# Altium project ChristmasTree.PrjPcb
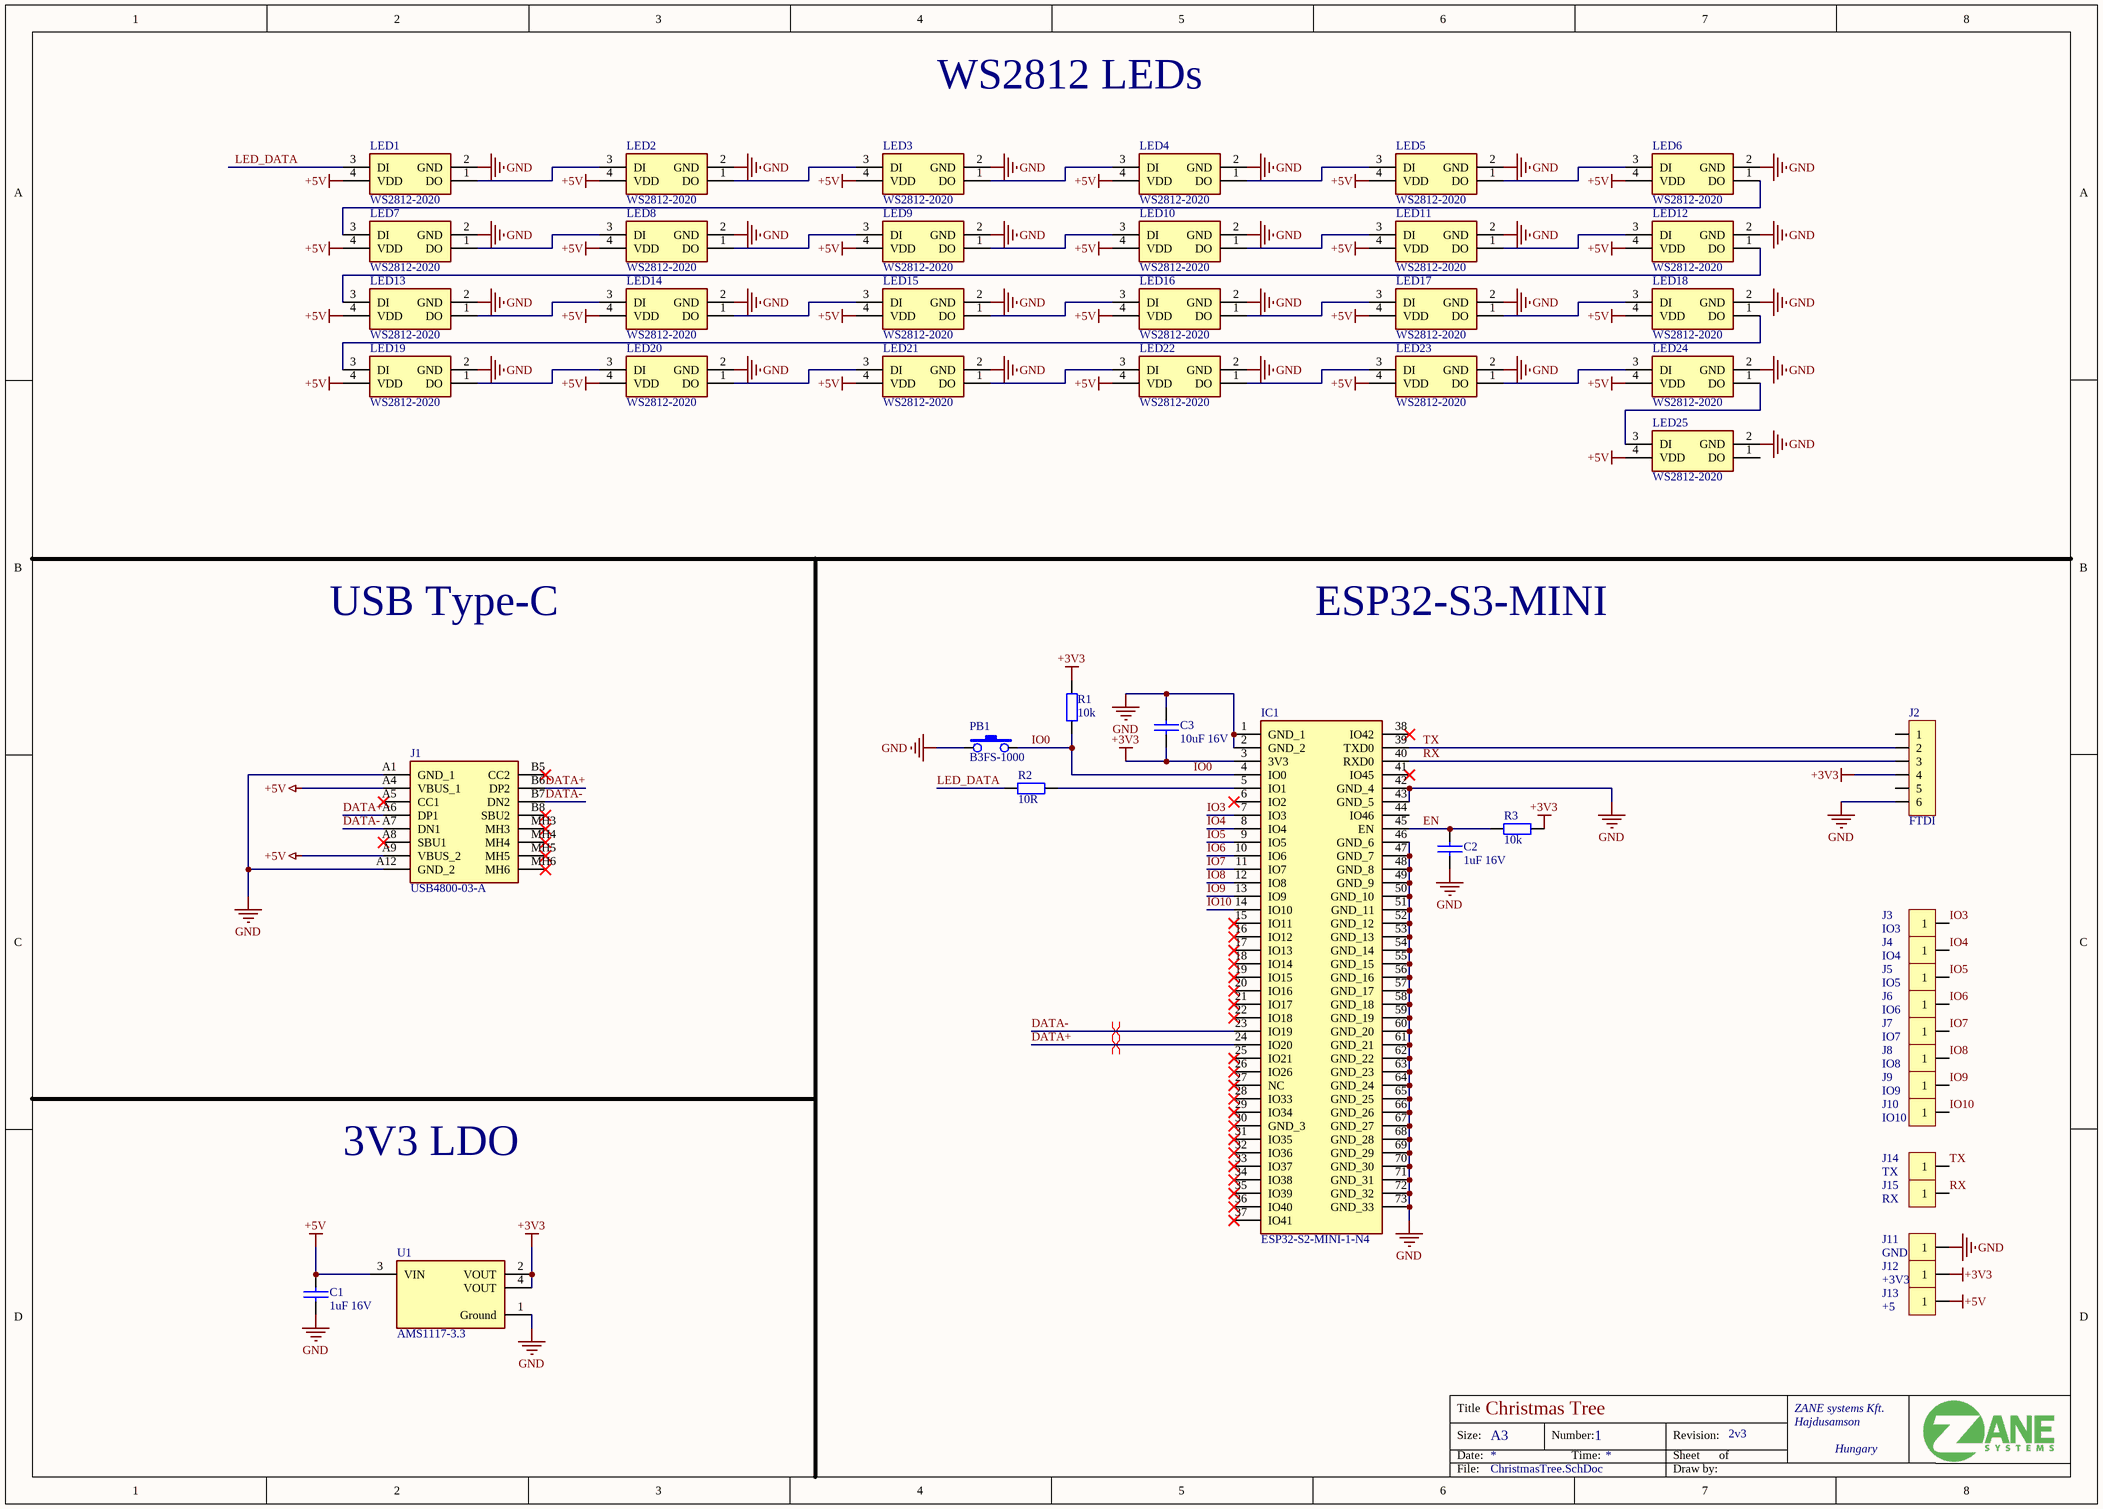
[diagram p0: ChristmasTree.SchDoc]
1 sheet, 49 parts. Net scope: global (net labels, ports and power ports of the same name join across sheets).
Board files: ChristmasTree.PcbDoc, ChristmasTree_x3_panellized.PcbDoc

## Sheet ChristmasTree.SchDoc: Christmas Tree
size A3; DrawnBy: ZANE systems Kft.; Organization: ZANE systems Kft.; Address1: Hajdusamson; Address4: Hungary; DocumentNumber: 1; Revision: 2v3; SheetNumber: 1; SheetTotal: 1

### Parts
C1  1uF 16V  [Z_0603_C]
C2  1uF 16V  [Z_0603_C]
C3  10uF 16V  [Z_0603_C]
IC1  ESP32-S2-MINI-1-N4  [ESP32S2MINI1N4]
J1  USB4800-03-A  [USB480003A]
J2  FTDI  [TUSKE1X6_2.54MM]
J3  IO3  [SMD_PAD]
J4  IO4  [SMD_PAD]
J5  IO5  [SMD_PAD]
J6  IO6  [SMD_PAD]
J7  IO7  [SMD_PAD]
J8  IO8  [SMD_PAD]
J9  IO9  [SMD_PAD]
J10  IO10  [SMD_PAD]
J11  GND  [SMD_PAD]
J12  +3V3  [SMD_PAD]
J13  +5  [SMD_PAD]
J14  TX  [SMD_PAD]
J15  RX  [SMD_PAD]
LED1  WS2812-2020  [WS28122020]
LED2  WS2812-2020  [WS28122020]
LED3  WS2812-2020  [WS28122020]
LED4  WS2812-2020  [WS28122020]
LED5  WS2812-2020  [WS28122020]
LED6  WS2812-2020  [WS28122020]
LED7  WS2812-2020  [WS28122020]
LED8  WS2812-2020  [WS28122020]
LED9  WS2812-2020  [WS28122020]
LED10  WS2812-2020  [WS28122020]
LED11  WS2812-2020  [WS28122020]
LED12  WS2812-2020  [WS28122020]
LED13  WS2812-2020  [WS28122020]
LED14  WS2812-2020  [WS28122020]
LED15  WS2812-2020  [WS28122020]
LED16  WS2812-2020  [WS28122020]
LED17  WS2812-2020  [WS28122020]
LED18  WS2812-2020  [WS28122020]
LED19  WS2812-2020  [WS28122020]
LED20  WS2812-2020  [WS28122020]
LED21  WS2812-2020  [WS28122020]
LED22  WS2812-2020  [WS28122020]
LED23  WS2812-2020  [WS28122020]
LED24  WS2812-2020  [WS28122020]
LED25  WS2812-2020  [WS28122020]
PB1  B3FS-1000  [dtsm3]
R1  10k  [z_0603_r]
R2  10R  [z_0603_r]
R3  10k  [z_0603_r]
U1  AMS1117-3.3  [FP-AMS1117-IPC_C]

### Nets
+3V3: C3.1 IC1.3(3V3) J2.4 J12.1 R1.2 R3.1 U1.2(VOUT) U1.4(VOUT)
+5V: C1.1 J1.A4(VBUS_1) J1.A9(VBUS_2) J13.1 LED1.4(VDD) LED2.4(VDD) LED3.4(VDD) LED4.4(VDD) LED5.4(VDD) LED6.4(VDD) LED7.4(VDD) LED8.4(VDD) LED9.4(VDD) LED10.4(VDD) LED11.4(VDD) LED12.4(VDD) LED13.4(VDD) LED14.4(VDD) LED15.4(VDD) LED16.4(VDD) LED17.4(VDD) LED18.4(VDD) LED19.4(VDD) LED20.4(VDD) LED21.4(VDD) LED22.4(VDD) LED23.4(VDD) LED24.4(VDD) LED25.4(VDD) U1.3(VIN)
GND: C1.2 C2.2 C3.2 IC1.1(GND_1) IC1.2(GND_2) IC1.42(GND_4) IC1.43(GND_5) IC1.46(GND_6) IC1.47(GND_7) IC1.48(GND_8) IC1.49(GND_9) IC1.50(GND_10) IC1.51(GND_11) IC1.52(GND_12) IC1.53(GND_13) IC1.54(GND_14) IC1.55(GND_15) IC1.56(GND_16) IC1.57(GND_17) IC1.58(GND_18) IC1.59(GND_19) IC1.60(GND_20) IC1.61(GND_21) IC1.62(GND_22) IC1.63(GND_23) IC1.64(GND_24) IC1.65(GND_25) IC1.66(GND_26) IC1.67(GND_27) IC1.68(GND_28) IC1.69(GND_29) IC1.70(GND_30) IC1.71(GND_31) IC1.72(GND_32) IC1.73(GND_33) J1.A1(GND_1) J1.A12(GND_2) J2.6 J11.1 LED1.2(GND) LED2.2(GND) LED3.2(GND) LED4.2(GND) LED5.2(GND) LED6.2(GND) LED7.2(GND) LED8.2(GND) LED9.2(GND) LED10.2(GND) LED11.2(GND) LED12.2(GND) LED13.2(GND) LED14.2(GND) LED15.2(GND) LED16.2(GND) LED17.2(GND) LED18.2(GND) LED19.2(GND) LED20.2(GND) LED21.2(GND) LED22.2(GND) LED23.2(GND) LED24.2(GND) LED25.2(GND) PB1.1 U1.1(Ground)
DATA+: IC1.24(IO20) J1.A6(DP1) J1.B6(DP2)
DATA-: IC1.23(IO19) J1.A7(DN1) J1.B7(DN2)
EN: C2.1 IC1.45(EN) R3.2
IO0: IC1.4(IO0) PB1.2 R1.1
IO3: IC1.7(IO3) J3.1
IO4: IC1.8(IO4) J4.1
IO5: IC1.9(IO5) J5.1
IO6: IC1.10(IO6) J6.1
IO7: IC1.11(IO7) J7.1
IO8: IC1.12(IO8) J8.1
IO9: IC1.13(IO9) J9.1
IO10: IC1.14(IO10) J10.1
LED_DATA: LED1.3(DI) R2.2
RX: IC1.40(RXD0) J2.3 J15.1
TX: IC1.39(TXD0) J2.2 J14.1
NetIC1_5: IC1.5(IO1) R2.1
NetLED1_1: LED1.1(DO) LED2.3(DI)
NetLED2_1: LED2.1(DO) LED3.3(DI)
NetLED3_1: LED3.1(DO) LED4.3(DI)
NetLED4_1: LED4.1(DO) LED5.3(DI)
NetLED5_1: LED5.1(DO) LED6.3(DI)
NetLED6_1: LED6.1(DO) LED7.3(DI)
NetLED7_1: LED7.1(DO) LED8.3(DI)
NetLED8_1: LED8.1(DO) LED9.3(DI)
NetLED9_1: LED9.1(DO) LED10.3(DI)
NetLED10_1: LED10.1(DO) LED11.3(DI)
NetLED11_1: LED11.1(DO) LED12.3(DI)
NetLED12_1: LED12.1(DO) LED13.3(DI)
NetLED13_1: LED13.1(DO) LED14.3(DI)
NetLED14_1: LED14.1(DO) LED15.3(DI)
NetLED15_1: LED15.1(DO) LED16.3(DI)
NetLED16_1: LED16.1(DO) LED17.3(DI)
NetLED17_1: LED17.1(DO) LED18.3(DI)
NetLED18_1: LED18.1(DO) LED19.3(DI)
NetLED19_1: LED19.1(DO) LED20.3(DI)
NetLED20_1: LED20.1(DO) LED21.3(DI)
NetLED21_1: LED21.1(DO) LED22.3(DI)
NetLED22_1: LED22.1(DO) LED23.3(DI)
NetLED23_1: LED23.1(DO) LED24.3(DI)
NetLED24_1: LED24.1(DO) LED25.3(DI)

Not connected (* = marked no-connect by the designer): IC1 6(IO2)* 15(IO11)* 16(IO12)* 17(IO13)* 18(IO14)* 19(IO15)* 20(IO16)* 21(IO17)* 22(IO18)* 25(IO21)* 26(IO26)* 27(NC)* 28(IO33)* 29(IO34)* 30(GND_3)* 31(IO35)* 32(IO36)* 33(IO37)* 34(IO38)* 35(IO39)* 36(IO40)* 37(IO41)* 38(IO42)* 41(IO45)* 44(IO46); J1 A5(CC1)* A8(SBU1)* B5(CC2)* B8(SBU2)* MH3* MH4* MH5* MH6*; J2 1 5; LED25 1(DO)

### Layout directives
differential pair: DATA+, DATA-

### Notes on the sheet
- WS2812 LEDs
- USB Type-C
- ESP32-S3-MINI
- 3V3 LDO
- Title
- Size:
- Date:
- A3
- Number:
- Time:
- Revision:
- Sheet
- of
- File:
- Draw by:

### Library data of the parts
C1-C3 = CAP_0805: =Value; VD: tme; MF: SAMSUNG; MN: CL10A106MO8NQNC; Power & Tolerance: 16V 20%; Price(HUF/1000): 6.5; Price(HUF/100): 15
  C1 C2: Value: 1uF 16V
  C3: Value: 10uF 16V
IC1 = ESP32-S2-MINI-1-N4: Integrated Circuit; Manufacturer_Name: Espressif Systems; Datasheet Link: https://www.espressif.com/sites/default/files/documentation/esp32-s2-mini-1_esp32-s2-mini-1u_datasheet_en.pdf; Height: 2.55mm; Manufacturer_Part_Number: ESP32-S2-MINI-1-N4; Mouser Part Number: 356-ESP32-S2-MINI-1; Mouser Price/Stock: https://www.mouser.co.uk/ProductDetail/Espressif-Systems/ESP32-S2-MINI-1-N4?qs=DPoM0jnrROXX974%252BTWoceA%3D%3D
J1 = USB4800-03-A: Connector; VD: Mouser; Value: 640-USB4800-03-A; MN: USB4800-03-A
J2 = CON6
J3-J15 = CON1
LED1-LED25 = WS2812-2020: LED; Manufacturer_Name: Worldsemi; Datasheet Link: http://www.world-semi.com/DownLoadFile/140; Height: 0.84mm; Manufacturer_Part_Number: WS2812-2020
PB1 = Push Button 2pin: Push Button; Contact Current Max: 50mA; Contact Voltage DC Nom: 24V; Supplier: Farnell; Supplier Part Number: 3121161
R1 R3 = Resistor: VD: tme; PN: SMD0402-10k-1%; MF: ROYAL OHM; Power & Tolerance: 0.1W; MN: SMD0402-10k-1%; Price(HUF/1000): 1; Value: 10k; Price(HUF/100): 2
R2 = Resistor: VD: tme; PN: SMD0402-10k-1%; MF: ROYAL OHM; Value: 10k; Power & Tolerance: 0.1W; MN: SMD0402-10k-1%; Price(HUF/1000): 1; Price(HUF/100): 2
U1 = CMP-209535-000001-1: LDO Voltage Regulators 1A, 3.3V; Manufacturer: Advanced Monolithic Systems; Dropout Voltage: 1.1V; Output Type: Fixed; Nominal Supply Current: 5mA; Max Power Dissipation: 1.2W; Max Supply Voltage: 15V; Number Of Outputs: 1; Standoff Height: 0.64mm; Max Junction Temp: +125°C; Height: 1.8mm; Package: AMS1117; Device Class L2: Power Management ICs; ComponentLink2Description: Datasheet; ComponentLink2URL: http://www.advanced-monolithic.com/pdf/ds1117.pdf; Category: IC; RoHS: TRUE; Automotive: No; Device Class L1: Integrated Circuits (ICs); Output Current: 1A; Device Class L3: Voltage Regulators - Linear; Temperature: -40°C to +125°C; Output Voltage: 3.3V; Manufacturer Part Number: AMS1117-3.3; Temperature Range Low: -40°C; Octopart: https://octopart.com/ams1117-3.3-advanced+monolithic+systems-25899300; Lead Free: Yes; Ipc Land Pattern Name: SOT229P700X180-4; Temperature Range High: +125°C